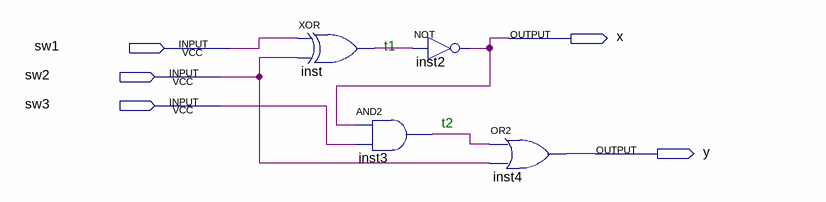
[diagram p0: schematic sheet]
// Quartus schematic example1.bdf as structural Verilog: 4 symbols, 5 pins
module example1 (
  input  sw1,
  input  sw2,
  input  sw3,
  output x,
  output y
);

  wire inst3_out, inst_out;

  xor inst (inst_out, sw1, sw2);
  and inst3 (inst3_out, x, sw3);
  not inst2 (x, inst_out);
  or inst4 (y, inst3_out, sw2);

  // Notes on the sheet:
  //   t1
  //   t2
endmodule
